# EAGLE design lichtenstein_onion (EAGLE 9.0.1)
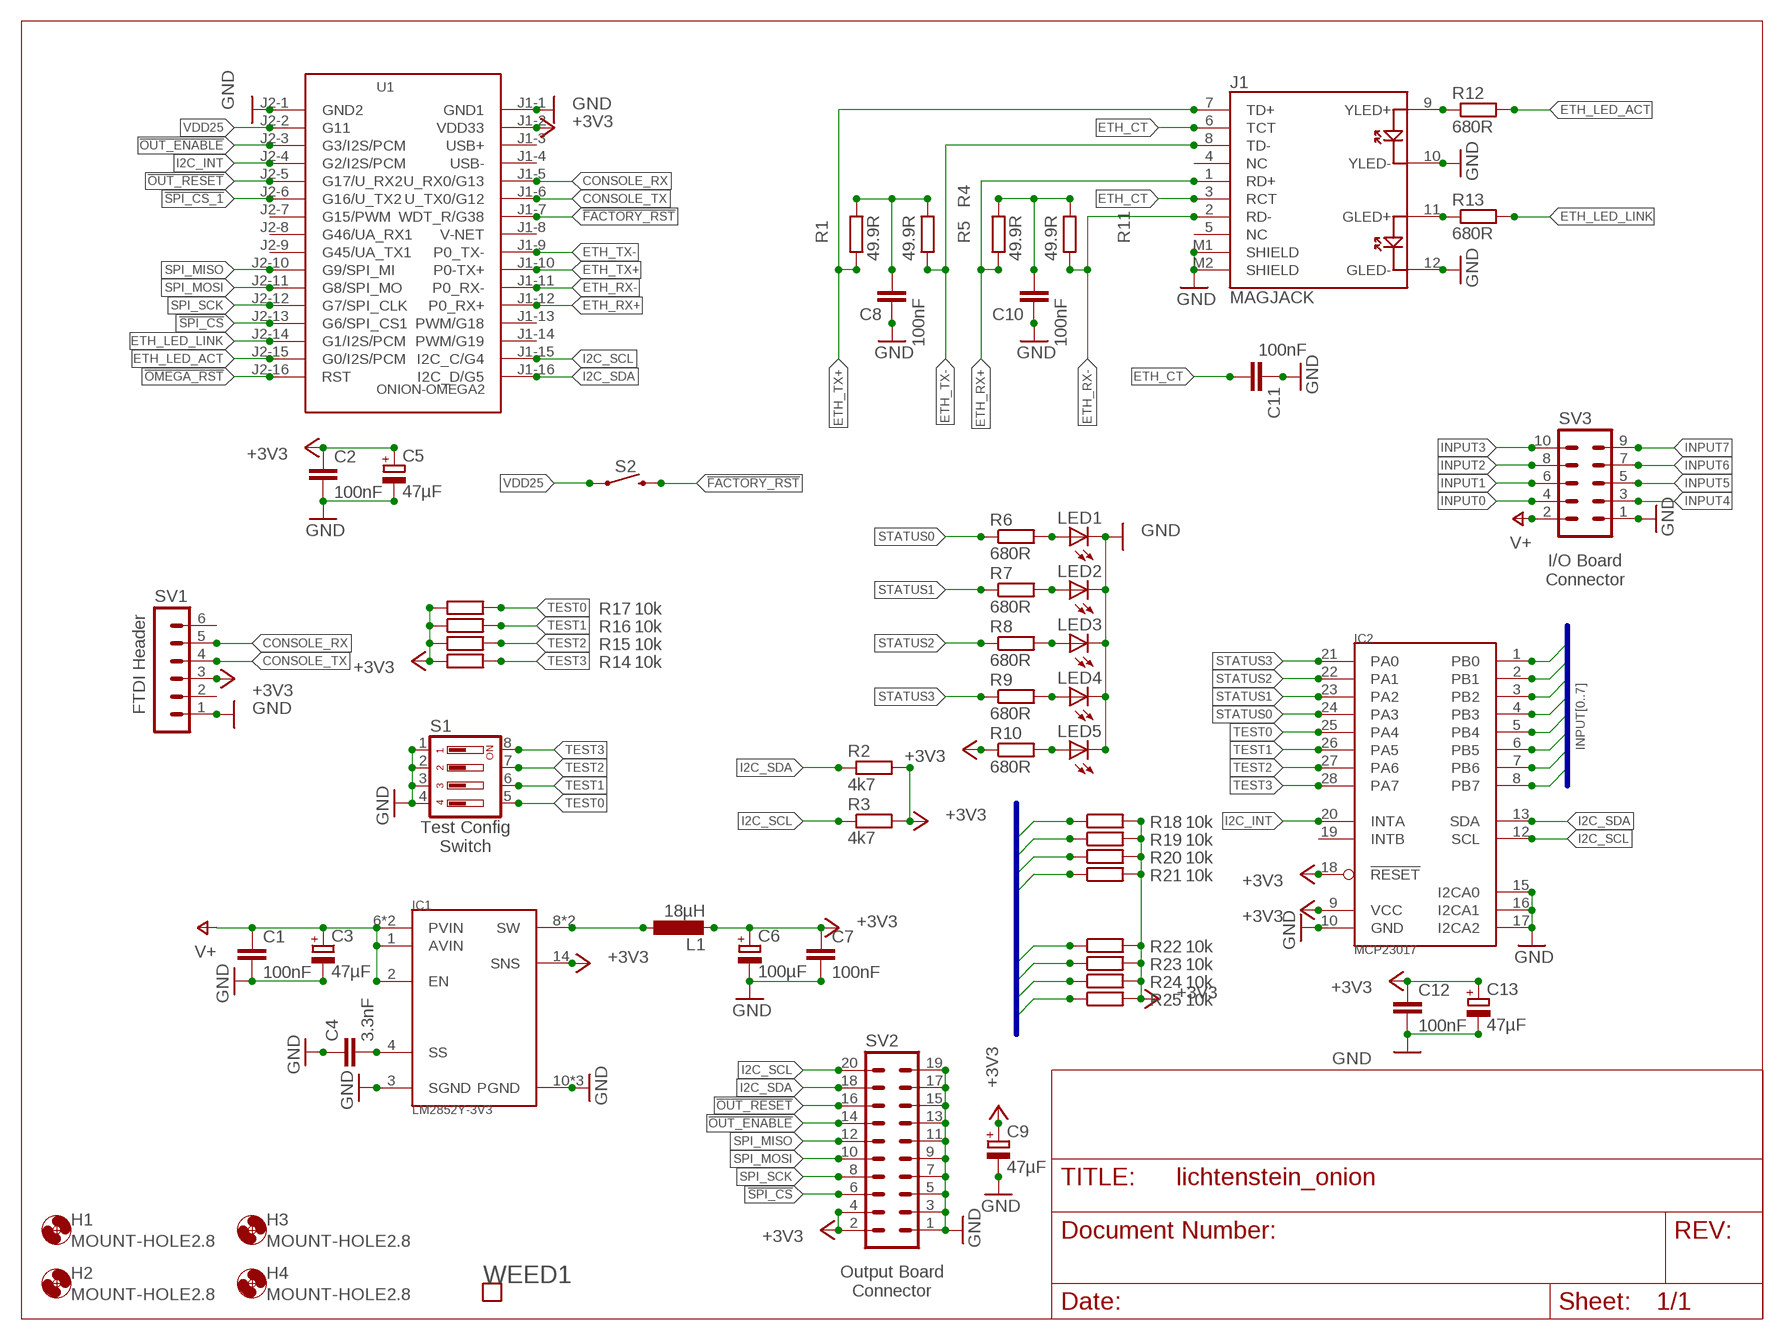
[diagram p0: schematic, sheet 1]

## Parts
C1  100nF  C-EUC0805  [C0805]
C2  100nF  C-EUC0805  [C0805]
C3  47µF  CPOL-EUCT7343  [CT7343]
C4  3.3nF  C-EUC0805  [C0805]
C5  47µF  CPOL-EUCT7343  [CT7343]
C6  100µF  CPOL-EUCT7343  [CT7343]
C7  100nF  C-EUC0805  [C0805]
C8  100nF  C-EUC0805  [C0805]
C9  47µF  CPOL-EUSMCD  [SMC_D]
C10  100nF  C-EUC0805  [C0805]
C11  100nF  C-EUC0805  [C0805]
C12  100nF  C-EUC0805  [C0805]
C13  47µF  CPOL-EUCT7343  [CT7343]
H1  MOUNT-HOLE2.8  [2,8]
H2  MOUNT-HOLE2.8  [2,8]
H3  MOUNT-HOLE2.8  [2,8]
H4  MOUNT-HOLE2.8  [2,8]
IC1  LM2852Y-3V3  LM2852HTSSOP14  [HTSSOP14]
IC2  MCP23017  MCP23017SSOP28  [SSOP28]
J1  MAGJACK  [MAGJACK]
L1  18µH  SRR1050A  [SRR1050A]
LED1  LEDCHIPLED_1206  [CHIPLED_1206]
LED2  LEDCHIPLED_1206  [CHIPLED_1206]
LED3  LEDCHIPLED_1206  [CHIPLED_1206]
LED4  LEDCHIPLED_1206  [CHIPLED_1206]
LED5  LEDCHIPLED_1206  [CHIPLED_1206]
R1  49.9R  R-EU_M0805  [M0805]
R2  4k7  R-EU_M0805  [M0805]
R3  4k7  R-EU_M0805  [M0805]
R4  49.9R  R-EU_M0805  [M0805]
R5  49.9R  R-EU_M0805  [M0805]
R6  680R  R-EU_M0805  [M0805]
R7  680R  R-EU_M0805  [M0805]
R8  680R  R-EU_M0805  [M0805]
R9  680R  R-EU_M0805  [M0805]
R10  680R  R-EU_M0805  [M0805]
R11  49.9R  R-EU_M0805  [M0805]
R12  680R  R-EU_M0805  [M0805]
R13  680R  R-EU_M0805  [M0805]
R14  10k  R-EU_M0805  [M0805]
R15  10k  R-EU_M0805  [M0805]
R16  10k  R-EU_M0805  [M0805]
R17  10k  R-EU_M0805  [M0805]
R18  10k  R-EU_M0805  [M0805]
R19  10k  R-EU_M0805  [M0805]
R20  10k  R-EU_M0805  [M0805]
R21  10k  R-EU_M0805  [M0805]
R22  10k  R-EU_M0805  [M0805]
R23  10k  R-EU_M0805  [M0805]
R24  10k  R-EU_M0805  [M0805]
R25  10k  R-EU_M0805  [M0805]
S1  219-04  [CTS-219-04]
S2  MOMENTARY-SWITCH-SPST-PTH-6.0MM  [TACTILE_SWITCH_PTH_6.0MM]
SV1  MA06-1  [MA06-1]
SV2  MA10-2  [MA10-2]
SV3  MA05-2  [MA05-2]
U1  ONION-OMEGA2  [ONION-2MM-2X16]
WEED1  WEED  [DOINK]

## Nets
!FACTORY_RST: S2.3 U1.J1-7(WDT_R/G38)
!OMEGA_RST: U1.J2-16(RST)
!OUT_ENABLE: SV2.14 U1.J2-3(G3/I2S/PCM)
!OUT_RESET: SV2.16 U1.J2-5(G17/U_RX2)
!SPI_CS: SV2.6 U1.J2-13(G6/SPI_CS1)
!SPI_CS_1: U1.J2-6(G16/U_TX2)
+3V3: C2.1 C5.+ C6.+ C7.1 C9.+ C12.1 C13.+ IC1.14(SNS) IC2.9(VCC) IC2.18(!RESET) L1.P$2 R2.2 R3.2 R10.1 R14.1 R15.1 R16.1 R17.1 R18.2 R19.2 R20.2 R21.2 R22.2 R23.2 R24.2 R25.2 SV1.3 SV2.2 SV2.4 U1.J1-2(VDD33)
CONSOLE_RX: SV1.5 U1.J1-5(U_RX0/G13)
CONSOLE_TX: SV1.4 U1.J1-6(U_TX0/G12)
ETH_CT: C11.2 J1.3(RCT) J1.6(TCT)
ETH_LED_ACT: R12.2 U1.J2-15(G0/I2S/PCM)
ETH_LED_LINK: R13.2 U1.J2-14(G1/I2S/PCM)
ETH_RX+: J1.1(RD+) R5.1 U1.J1-12(P0_RX+)
ETH_RX-: J1.2(RD-) R11.1 U1.J1-11(P0_RX-)
ETH_TX+: J1.7(TD+) R1.1 U1.J1-10(P0-TX+)
ETH_TX-: J1.8(TD-) R4.1 U1.J1-9(P0_TX-)
GND: C1.2 C2.2 C3.- C4.1 C5.- C6.- C7.2 C8.1 C9.- C10.1 C11.1 C12.2 C13.- IC1.3(SGND) IC1.10(PGND) IC1.11(PGND) IC1.PAD(PGND) IC2.10(GND) IC2.15(I2CA0) IC2.16(I2CA1) IC2.17(I2CA2) J1.10(YLED-) J1.12(GLED-) J1.M1(SHIELD) J1.M2(SHIELD) LED1.C LED2.C LED3.C LED4.C LED5.C S1.1 S1.2 S1.3 S1.4 SV1.1 SV2.1 SV2.3 SV2.5 SV2.7 SV2.9 SV2.11 SV2.13 SV2.15 SV2.17 SV2.19 SV3.1 U1.J1-1(GND1) U1.J2-1(GND2)
I2C_INT: IC2.20(INTA) U1.J2-4(G2/I2S/PCM)
I2C_SCL: IC2.12(SCL) R3.1 SV2.20 U1.J1-15(I2C_C/G4)
I2C_SDA: IC2.13(SDA) R2.1 SV2.18 U1.J1-16(I2C_D/G5)
INPUT0: IC2.2(PB1) R18.1 SV3.4
INPUT1: IC2.4(PB3) R19.1 SV3.6
INPUT2: IC2.6(PB5) R24.1 SV3.8
INPUT3: IC2.8(PB7) R25.1 SV3.10
INPUT4: IC2.1(PB0) R20.1 SV3.3
INPUT5: IC2.3(PB2) R21.1 SV3.5
INPUT6: IC2.5(PB4) R23.1 SV3.7
INPUT7: IC2.7(PB6) R22.1 SV3.9
N$1: LED5.A R10.2
N$2: LED1.A R6.2
N$3: C8.2 R1.2 R4.2
N$4: J1.9(YLED+) R12.1
N$5: J1.11(GLED+) R13.1
N$6: C10.2 R5.2 R11.2
N$7: IC1.8(SW) IC1.9(SW) L1.P$1
N$8: C4.2 IC1.4(SS)
N$9: LED2.A R7.2
N$10: LED3.A R8.2
N$11: LED4.A R9.2
SPI_MISO: SV2.12 U1.J2-10(G9/SPI_MI)
SPI_MOSI: SV2.10 U1.J2-11(G8/SPI_MO)
SPI_SCK: SV2.8 U1.J2-12(G7/SPI_CLK)
STATUS0: IC2.24(PA3) R6.1
STATUS1: IC2.23(PA2) R7.1
STATUS2: IC2.22(PA1) R8.1
STATUS3: IC2.21(PA0) R9.1
TEST0: IC2.25(PA4) R17.2 S1.5
TEST1: IC2.26(PA5) R16.2 S1.6
TEST2: IC2.27(PA6) R15.2 S1.7
TEST3: IC2.28(PA7) R14.2 S1.8
V+: C1.1 C3.+ IC1.1(AVIN) IC1.2(EN) IC1.6(PVIN) IC1.7(PVIN) SV3.2
VDD25: S2.1 U1.J2-2(G11)
Unconnected: IC2.19(INTB) J1.4(NC) J1.5(NC) SV1.2 SV1.6 U1.J1-3(USB+) U1.J1-4(USB-) U1.J1-8(V-NET) U1.J1-13(PWM/G18) U1.J1-14(PWM/G19) U1.J2-7(G15/PWM) U1.J2-8(G46/UA_RX1) U1.J2-9(G45/UA_TX1)

## Buses
INPUT[0..7]

## Notes on the sheet
- I/O Board
  Connector
- FTDI Header
- Test Config
  Switch
- Output Board
  Connector

## Library data of the parts
C1 C2 C7 C8 C10-C12 = rcl:C-EU: CAPACITOR, European symbol; MOUSER: 710-885012207072; SPICEPREFIX: C
C3 C5 C9 C13 = rcl:CPOL-EU: POLARIZED CAPACITOR, European symbol; MOUSER: 581-TAJD476M016RNJV; SPICEPREFIX: C
C4 = rcl:C-EU: CAPACITOR, European symbol; MOUSER: 710-885012207089; SPICEPREFIX: C
C6 = rcl:CPOL-EU: POLARIZED CAPACITOR, European symbol; MOUSER: 581-NOSD107M006; SPICEPREFIX: C
H1-H4 = holes:MOUNT-HOLE: MOUNTING HOLE with drill center marker
IC1 = lichtenstein_onion:LM2852: 2A 500/1500kHz Synchronous Buck Regulator Information <http://www.ti.com/product/lm2852/description>; MOUSER: 926-LM2852YMXA33NOPB
IC2 = lichtenstein_onion:MCP23017; MOUSER: 579-MCP23017T-E/SS
J1 = SparkFun-Connectors:MAGJACK: MAGJACK: RJ-45 with LEDs This is a single port, RJ45 ethernet jacks with built in transformer (magnetics), status LEDs, and shielding. Here is the connector we sell at SparkFun: RJ45 Ethernet MagJack-Compatible <https://www.sparkfun.com/products/8534> (PRT-08534) Datasheet <http://www.sparkfun.com/datasheets/Prototyping/MagJack.pdf> It is used on this SparkFun product: SparkFun RJ45 MagJack Breakout <https://www.sparkfun.com/products/13021> (BOB-13021); PROD_ID: CONN-09556; SF_ID: PRT-08534
L1 = lichtenstein_onion:SRR1050A: SRR1050A Series - Shielded Power Inductors Datasheet <https://www.mouser.com/datasheet/2/54/rr1050a-964771.pdf>; MOUSER: 652-SRR1050A-180Y
LED1 = led:LED: LED OSRAM: - CHIPLED LG R971, LG N971, LY N971, LG Q971, LY Q971, LO R971, LY R971 LH N974, LH R974 LS Q976, LO Q976, LY Q976 LO Q996 - Hyper CHIPLED LW Q18S LB Q993, LB Q99A, LB R99A - SideLED LS A670, LO A670, LY A670, LG A670, LP A670 LB A673, LV A673, LT A673, LW A673 LH A674 LY A675 LS A676, LA A676, LO A676, LY A676, LW A676 LS A679, LY A679, LG A679 - Hyper Micro SIDELED® LS Y876, LA Y876, LO Y876, LY Y876 LT Y87S - SmartLED LW L88C, LW L88S LB L89C, LB L89S, LG L890 LS L89K, LO L89K, LY L89K LS L896, LA L896, LO L896, LY L896 - TOPLED LS T670, LO T670, LY T670, LG T670, LP T670 LSG T670, LSP T670, LSY T670, LOP T670, LYG T670 LG T671, LOG T671, LSG T671 LB T673, LV T673, LT T673, LW T673 LH T674 LS T676, LA T676, LO T676, LY T676, LB T676, LH T676, LSB T676, LW T676 LB T67C, LV T67C, LT T67C, LS T67K, LO T67K, LY T67K, LW E67C LS E67B, LA E67B, LO E67B, LY E67B, LB E67C, LV E67C, LT E67C LW T67C LS T679, LY T679, LG T679 LS T770, LO T770, LY T770, LG T770, LP T770 LB T773, LV T773, LT T773, LW T773 LH T774 LS E675, LA E675, LY E675, LS T675 LS T776, LA T776, LO T776, LY T776, LB T776 LHGB T686 LT T68C, LB T68C - Hyper Mini TOPLED® LB M676 - Mini TOPLED Santana® LG M470 LS M47K, LO M47K, LY M47K Source: http://www.osram.convergy.de LUXEON: - LUMILED® LXK2-PW12-R00, LXK2-PW12-S00, LXK2-PW14-U00, LXK2-PW14-V00 LXK2-PM12-R00, LXK2-PM12-S00, LXK2-PM14-U00 LXK2-PE12-Q00, LXK2-PE12-R00, LXK2-PE12-S00, LXK2-PE14-T00, LXK2-PE14-U00 LXK2-PB12-K00, LXK2-PB12-L00, LXK2-PB12-M00, LXK2-PB14-N00, LXK2-PB14-P00, LXK2-PB14-Q00 LXK2-PR12-L00, LXK2-PR12-M00, LXK2-PR14-Q00, LXK2-PR14-R00 LXK2-PD12-Q00, LXK2-PD12-R00, LXK2-PD12-S00 LXK2-PH12-R00, LXK2-PH12-S00 LXK2-PL12-P00, LXK2-PL12-Q00, LXK2-PL12-R00 Source: www.luxeon.com KINGBRIGHT: KA-3528ASYC Source: www.kingbright.com; MOUSER: 604-APTR3216SRCPRV
LED2-LED5 = led:LED: LED OSRAM: - CHIPLED LG R971, LG N971, LY N971, LG Q971, LY Q971, LO R971, LY R971 LH N974, LH R974 LS Q976, LO Q976, LY Q976 LO Q996 - Hyper CHIPLED LW Q18S LB Q993, LB Q99A, LB R99A - SideLED LS A670, LO A670, LY A670, LG A670, LP A670 LB A673, LV A673, LT A673, LW A673 LH A674 LY A675 LS A676, LA A676, LO A676, LY A676, LW A676 LS A679, LY A679, LG A679 - Hyper Micro SIDELED® LS Y876, LA Y876, LO Y876, LY Y876 LT Y87S - SmartLED LW L88C, LW L88S LB L89C, LB L89S, LG L890 LS L89K, LO L89K, LY L89K LS L896, LA L896, LO L896, LY L896 - TOPLED LS T670, LO T670, LY T670, LG T670, LP T670 LSG T670, LSP T670, LSY T670, LOP T670, LYG T670 LG T671, LOG T671, LSG T671 LB T673, LV T673, LT T673, LW T673 LH T674 LS T676, LA T676, LO T676, LY T676, LB T676, LH T676, LSB T676, LW T676 LB T67C, LV T67C, LT T67C, LS T67K, LO T67K, LY T67K, LW E67C LS E67B, LA E67B, LO E67B, LY E67B, LB E67C, LV E67C, LT E67C LW T67C LS T679, LY T679, LG T679 LS T770, LO T770, LY T770, LG T770, LP T770 LB T773, LV T773, LT T773, LW T773 LH T774 LS E675, LA E675, LY E675, LS T675 LS T776, LA T776, LO T776, LY T776, LB T776 LHGB T686 LT T68C, LB T68C - Hyper Mini TOPLED® LB M676 - Mini TOPLED Santana® LG M470 LS M47K, LO M47K, LY M47K Source: http://www.osram.convergy.de LUXEON: - LUMILED® LXK2-PW12-R00, LXK2-PW12-S00, LXK2-PW14-U00, LXK2-PW14-V00 LXK2-PM12-R00, LXK2-PM12-S00, LXK2-PM14-U00 LXK2-PE12-Q00, LXK2-PE12-R00, LXK2-PE12-S00, LXK2-PE14-T00, LXK2-PE14-U00 LXK2-PB12-K00, LXK2-PB12-L00, LXK2-PB12-M00, LXK2-PB14-N00, LXK2-PB14-P00, LXK2-PB14-Q00 LXK2-PR12-L00, LXK2-PR12-M00, LXK2-PR14-Q00, LXK2-PR14-R00 LXK2-PD12-Q00, LXK2-PD12-R00, LXK2-PD12-S00 LXK2-PH12-R00, LXK2-PH12-S00 LXK2-PL12-P00, LXK2-PL12-Q00, LXK2-PL12-R00 Source: www.luxeon.com KINGBRIGHT: KA-3528ASYC Source: www.kingbright.com; MOUSER: 604-APTR3216SGC
R1 R5 R11 = rcl:R-EU_: RESISTOR, European symbol; MOUSER: 652-CR0805FX-49R9ELF; SPICEPREFIX: R
R2-R4 = rcl:R-EU_: RESISTOR, European symbol; MOUSER: 652-CR0805-FX4701GLF; SPICEPREFIX: R
R6-R10 R12 R13 = rcl:R-EU_: RESISTOR, European symbol; MOUSER: 652-CR0805-FX6800GLF; SPICEPREFIX: R
R14-R25 = rcl:R-EU_: RESISTOR, European symbol; MOUSER: 652-CR0805FX-1002ELF; SPICEPREFIX: R
S1 = switch-dil:219-04*: Surface Mount DIP Switch Series 219 SMT CTS Electronic Components Sourc: www.ctscorp.com; MOUSER: 774-219-4LPS; OC_FARNELL: unknown; OC_NEWARK: unknown
S2 = SparkFun-Switches:MOMENTARY-SWITCH-SPST: Momentary Switch (Pushbutton) - SPST Normally-open (NO) SPST momentary switches (buttons, pushbuttons). Variants PTH-12MM - 12mm square, through-hole Momentary Pushbutton Switch - 12mm Square <https://www.sparkfun.com/products/9190> (COM-09190) PTH-6.0MM, PTH-6.0MM-KIT - 6.0mm square, through-hole Mini Pushbutton Switch <https://www.sparkfun.com/products/97> (COM-00097) KIT package intended for soldering kit's - only one side of pads' copper is exposed. PTH-RIGHT-ANGLE-KIT - Right-angle, through-hole Right Angle Tactile Button <https://www.sparkfun.com/products/10791> - Used on SparkFun BigTime Watch Kit <https://www.sparkfun.com/products/11734> SMD-12MM - 12mm square, surface-mount Tactile Button - SMD (12mm) <https://www.sparkfun.com/products/12993> (COM-12993) Used on SparkFun PicoBoard <https://www.sparkfun.com/products/11888> SMD-4.5MM - 4.5mm Square Trackball Switch Used on SparkFun Blackberry Trackballer Breakout <https://www.sparkfun.com/products/13169> SMD-4.6MMX2.8MM - 4.60mm x 2.80mm, surface mount Used on SparkFun SAMD21 Mini Breakout <https://www.sparkfun.com/products/13664> SMD-5.2MM, SMD-5.2-REDUNDANT - 5.2mm square, surface-mount Mini Pushbutton Switch - SMD <https://www.sparkfun.com/products/8720> (COM-08720) Used on Arduino Pro Mini <https://www.sparkfun.com/products/11114> REDUNDANT package connects both switch circuits together SMD-6.0X3.5MM - 6.0 x 3.5mm, surface mount Momentary Reset Switch SMD <https://www.sparkfun.com/products/8229> (COM-08229) SMD-6.2MM-TALL - 6.2mm square, surface mount Tactile Button - SMD (6mm) <https://www.sparkfun.com/products/12992> Used on SparkFun Digital Sandbox <https://www.sparkfun.com/products/12651> SMD-RIGHT-ANGLE - Right-angle, surface mount Used on SparkFun Block for Intel® Edison - Arduino <https://www.sparkfun.com/products/13036>; MOUSER: 612-TL1105B; PROD_ID: SWCH-08441; SF_SKU: COM-00097
SV1 = con-lstb:MA06-1: PIN HEADER; OC_FARNELL: unknown; OC_NEWARK: unknown
SV2 = con-lstb:MA10-2: PIN HEADER; MOUSER: 517-30320-6002; OC_FARNELL: unknown; OC_NEWARK: unknown
SV3 = con-lstb:MA05-2: PIN HEADER; MOUSER: 517-30310-6002; OC_FARNELL: unknown; OC_NEWARK: unknown
U1 = lichtenstein_onion:ONION-OMEGA2: Onion Omega; MOUSER: 353-OM-O2P
WEED1 = lichtenstein_onion:WEED

## Board
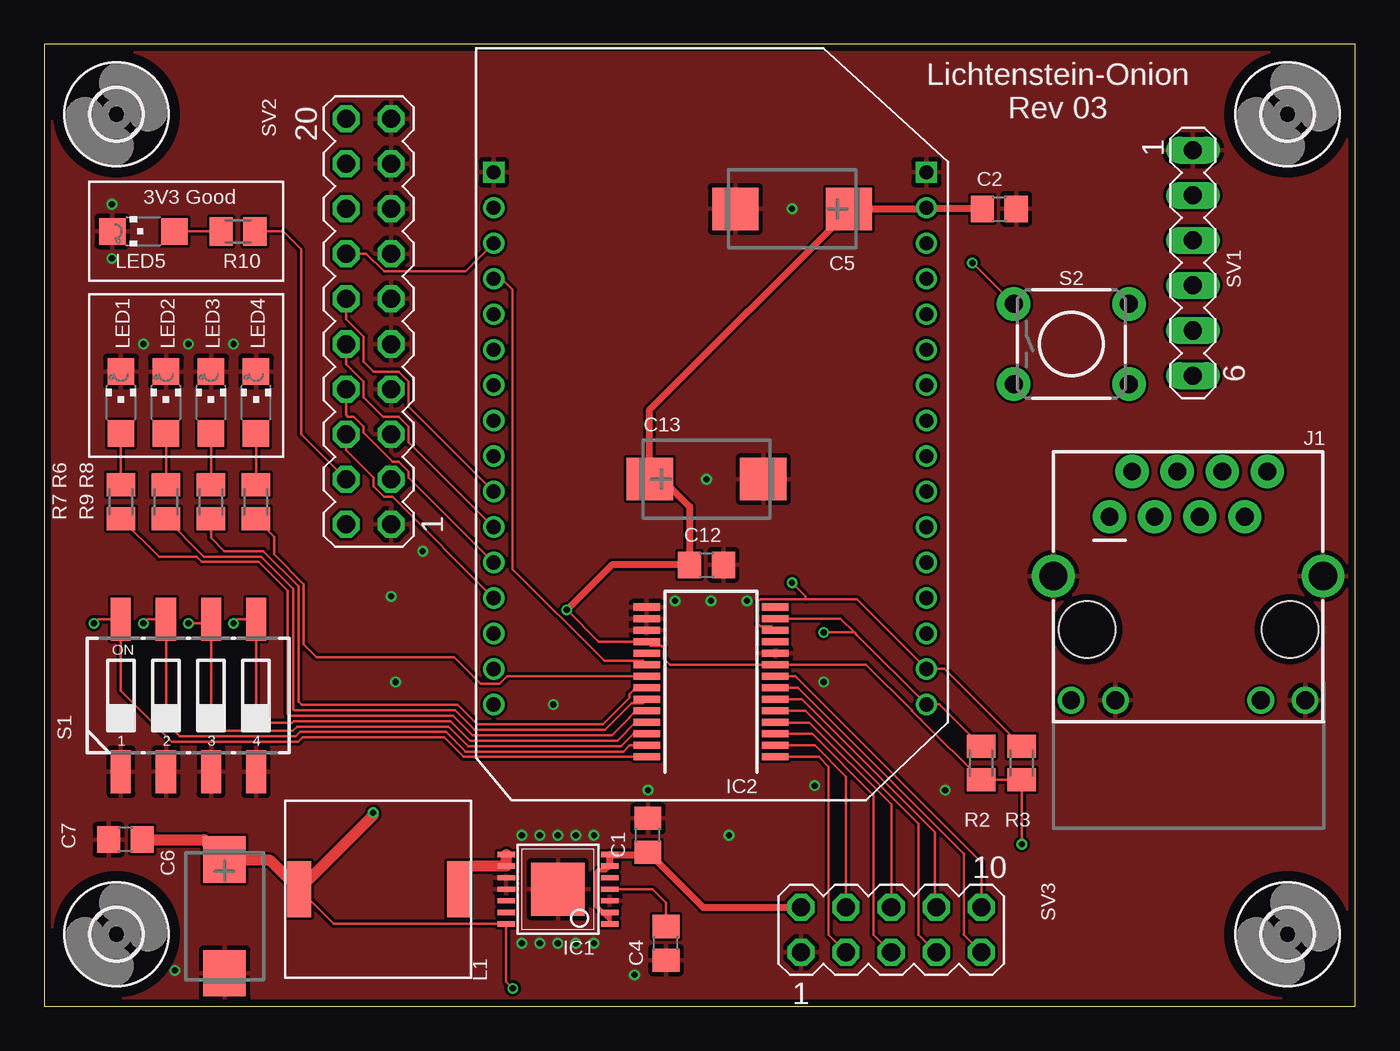
[diagram p1: board, top side]
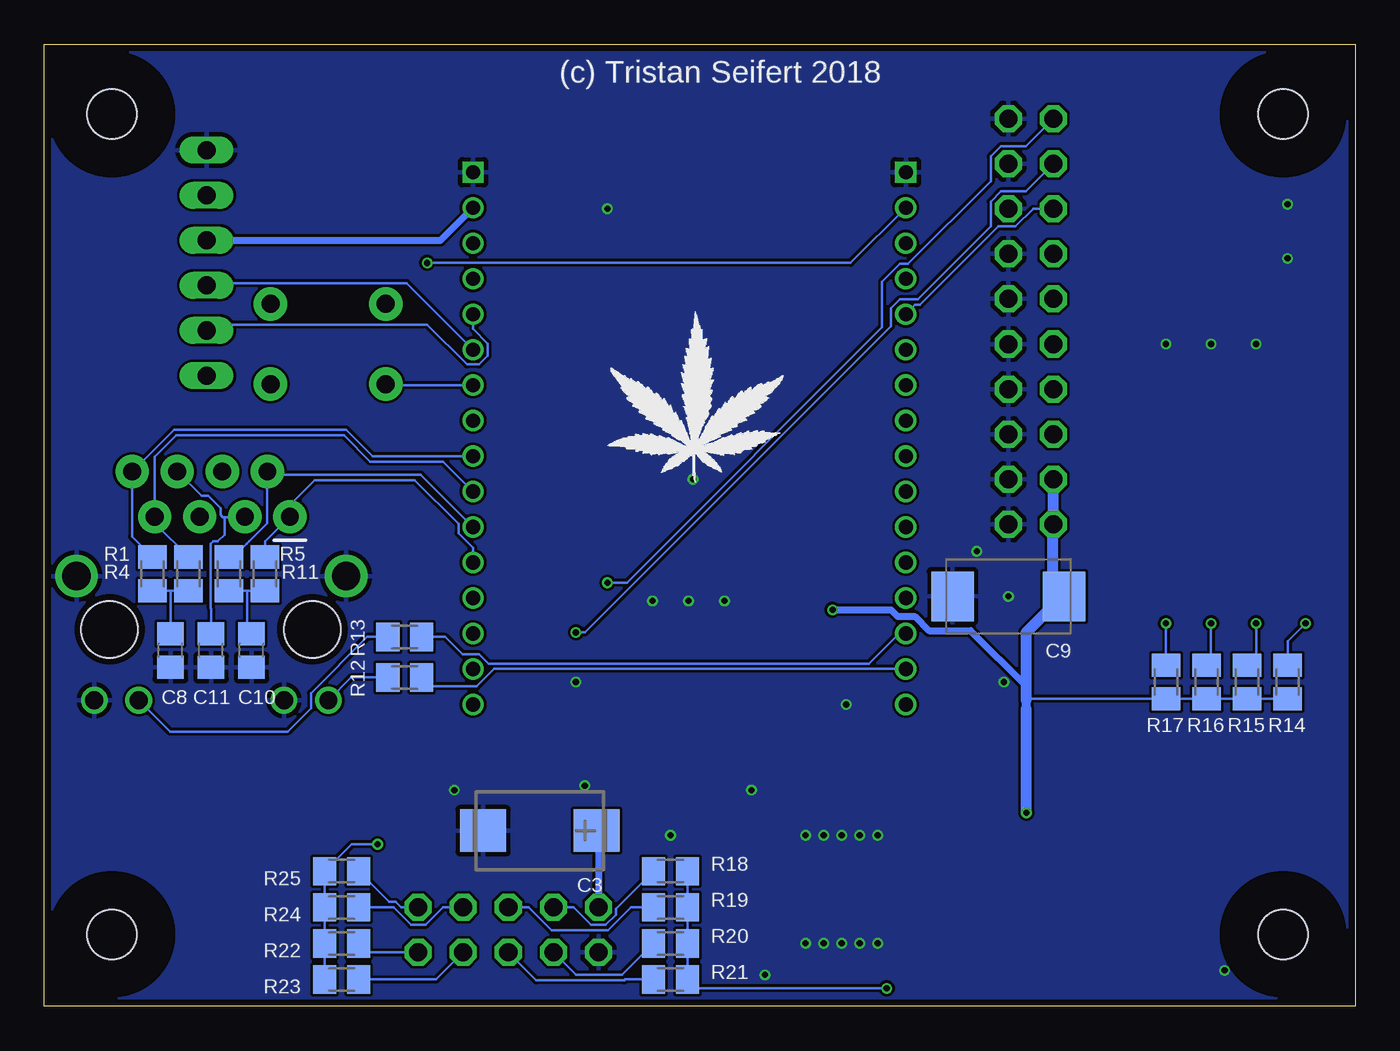
[diagram p2: board, bottom side, seen from below]

Size 73.91 x 54.23 mm. Coordinates in mm from the lower left corner, seen from the top.
Outline: 0,0 73.91,0 73.91,54.23 0,54.23 0,0
Copper layers (1*16): Top 0.035559375mm / dielectric 1.6mm / Bottom 0.035559375mm
Design rules "oshpark-2layer": minimum track width 6mil, minimum drill 10mil, track to track 6mil, track to pad 6mil, pad to pad 6mil, via to via 6mil, smd to smd 6mil, copper to edge 15mil, drill to drill 6mil, minimum pad ring 5mil, minimum via ring 5mil, stop-mask expansion 2.5mil, vias tented up to drill 0mil, thermal gap 10mil

### Footprints (pad centres in the part's own frame; a part is rotated, then mirrored left to right if it is on the bottom)
C0805 = smd 1.3 x 1.5: 1 -0.95,0; 2 0.95,0
CT7343 = smd 2.6 x 2.4: + -3.2,0; - 3.2,0
SMC_D = smd 2.4 x 2.8: + -3.15,0; - 3.15,0
2,8 = hole 2.8: 0,0
HTSSOP14 = smd 0.305 x 0.991: 1 -1.95,-2.918; 2 -1.3,-2.918; 3 -0.65,-2.918; 4 0,-2.918; 5 0.65,-2.918; 6 1.3,-2.918; 7 1.95,-2.918; 8 1.95,2.918; 9 1.3,2.918; 10 0.65,2.918; 11 0,2.918; 12 -0.65,2.918; 13 -1.3,2.918; 14 -1.95,2.918 | smd 3 x 3: PAD 0,0
SSOP28 = smd 0.4 x 1.5: 1 -4.225,-3.625; 2 -3.575,-3.625; 3 -2.925,-3.625; 4 -2.275,-3.625; 5 -1.625,-3.625; 6 -0.975,-3.625; 7 -0.325,-3.625; 8 0.325,-3.625; 9 0.975,-3.625; 10 1.625,-3.625; 11 2.275,-3.625; 12 2.925,-3.625; 13 3.575,-3.625; 14 4.225,-3.625; 15 4.225,3.625; 16 3.575,3.625; 17 2.925,3.625; 18 2.275,3.625; 19 1.625,3.625; 20 0.975,3.625; 21 0.325,3.625; 22 -0.325,3.625; 23 -0.975,3.625; 24 -1.625,3.625; 25 -2.275,3.625; 26 -2.925,3.625; 27 -3.575,3.625; 28 -4.225,3.625
MAGJACK = drill 1 pad 1.88: 1 3.175,17.445; 2 4.445,19.985; 3 5.715,17.445; 4 6.985,19.985; 5 8.255,17.445; 6 9.525,19.985; 7 10.795,17.445; 8 12.065,19.985 | drill 1 pad 1.27: 9 1,7.1; 10 3.5,7.1; 11 11.7,7.1; 12 14.2,7.1 | drill 1.6 pad 2.184: M1 0,14.1; M2 15.2,14.1 | hole 3.2: 1.905,11.095; 13.335,11.095
SRR1050A = smd 3.15 x 1.325: P$1 0,0; P$2 0,-9
CHIPLED_1206 = smd 1.5 x 1.5: A 0,-1.75; C 0,1.75
M0805 = smd 1.3 x 1.6: 1 -0.95,0; 2 0.95,0
CTS-219-04 = smd 1.13 x 2.44: 1 -3.81,-4.3; 2 -1.27,-4.3; 3 1.27,-4.3; 4 3.81,-4.3; 5 3.81,4.3; 6 1.27,4.3; 7 -1.27,4.3; 8 -3.81,4.3
TACTILE_SWITCH_PTH_6.0MM = drill 1.016 pad 1.88: 1 -3.251,2.261; 2 3.251,2.261; 3 -3.251,-2.261; 4 3.251,-2.261
MA06-1 = drill 1.016 long: 1 -6.35,0; 2 -3.81,0; 3 -1.27,0; 4 1.27,0; 5 3.81,0; 6 6.35,0
MA10-2 = drill 1.016 octagon: 1 -11.43,-1.27; 2 -11.43,1.27; 3 -8.89,-1.27; 4 -8.89,1.27; 5 -6.35,-1.27; 6 -6.35,1.27; 7 -3.81,-1.27; 8 -3.81,1.27; 9 -1.27,-1.27; 10 -1.27,1.27; 11 1.27,-1.27; 12 1.27,1.27; 13 3.81,-1.27; 14 3.81,1.27; 15 6.35,-1.27; 16 6.35,1.27; 17 8.89,-1.27; 18 8.89,1.27; 19 11.43,-1.27; 20 11.43,1.27
MA05-2 = drill 1.016 octagon: 1 -5.08,-1.27; 2 -5.08,1.27; 3 -2.54,-1.27; 4 -2.54,1.27; 5 0,-1.27; 6 0,1.27; 7 2.54,-1.27; 8 2.54,1.27; 9 5.08,-1.27; 10 5.08,1.27
ONION-2MM-2X16 = drill 0.8 square: J1-1 12.4,14; J2-1 -12,14 | drill 0.8: J1-2 12.4,12; J1-3 12.4,10; J1-4 12.4,8; J1-5 12.4,6; J1-6 12.4,4; J1-7 12.4,2; J1-8 12.4,0; J1-9 12.4,-2; J1-10 12.4,-4; J1-11 12.4,-6; J1-12 12.4,-8; J1-13 12.4,-10; J1-14 12.4,-12; J1-15 12.4,-14; J1-16 12.4,-16; J2-2 -12,12; J2-3 -12,10; J2-4 -12,8; J2-5 -12,6; J2-6 -12,4; J2-7 -12,2; J2-8 -12,0; J2-9 -12,-2; J2-10 -12,-4; J2-11 -12,-6; J2-12 -12,-8; J2-13 -12,-10; J2-14 -12,-12; J2-15 -12,-14; J2-16 -12,-16

### Placement (x,y rotation side)
C1  34.04,9.65 90 top
C2  53.85,44.96 0 top
C3  45.97,9.91 180 bottom
C4  35.05,3.56 90 top
C5  42.16,44.96 180 top
C6  10.16,5.08 270 top
C7  4.57,9.4 180 top
C8  66.8,20.07 90 bottom
C9  19.56,23.11 180 bottom
C10  62.23,20.07 90 bottom
C11  64.52,20.07 90 bottom
C12  37.34,24.89 0 top
C13  37.34,29.72 0 top
H1  4.06,4.06 0 top
H2  70.1,4.06 0 top
H3  4.06,50.29 0 top
H4  70.1,50.29 0 top
IC1  28.96,6.6 90 top
IC2  37.59,18.29 90 top
J1  56.9,10.16 0 top
L1  23.37,6.6 270 top
LED1  4.32,34.04 0 top
LED2  6.86,34.04 0 top
LED3  9.4,34.04 0 top
LED4  11.94,34.04 0 top
LED5  5.59,43.69 90 top
R1  65.79,24.38 270 bottom
R2  52.83,13.72 270 top
R3  55.12,13.72 270 top
R4  67.82,24.38 270 bottom
R5  61.47,24.38 270 bottom
R6  4.32,28.45 90 top
R7  6.86,28.45 90 top
R8  9.4,28.45 90 top
R9  11.94,28.45 90 top
R10  10.92,43.69 180 top
R11  63.5,24.38 270 bottom
R12  53.59,18.54 0 bottom
R13  53.59,20.83 0 bottom
R14  3.81,18.29 90 bottom
R15  6.1,18.29 90 bottom
R16  8.38,18.29 90 bottom
R17  10.67,18.29 90 bottom
R18  38.61,7.62 0 bottom
R19  38.61,5.59 0 bottom
R20  38.61,3.56 0 bottom
R21  38.61,1.52 0 bottom
R22  57.15,3.56 180 bottom
R23  57.15,1.52 180 bottom
R24  57.15,5.59 180 bottom
R25  57.15,7.62 180 bottom
S1  8.13,17.53 0 top
S2  57.91,37.34 0 top
SV1  64.77,41.91 270 top
SV2  18.29,38.61 90 top
SV3  47.75,4.32 0 top
U1  37.34,33.02 0 top
WEED1  42.16,29.46 0 bottom

### Tracks (layer width: path | path; a pad name or v marks a point on that pad's centre or on a via)
!FACTORY_RST
  Bottom 0.152: U1.J1-7 54.6,35.02 S2.3
!OUT_ENABLE
  Top 0.152: SV2.14 18.16,42.42 19.15,41.43 23.75,41.43 U1.J2-3
!OUT_RESET
  Bottom 0.152: U1.J2-5 24.81,39.54 24.54,39.54 20.12,43.97 19.15,43.97 18.16,44.96 SV2.16
!SPI_CS
  Top 0.152: SV2.6 17.02,31.34 18.57,29.79 18.57,29.31 19.15,28.73 19.63,28.73 U1.J2-13
+3V3  (via drill 0.35)
  Top 0.152: 49.68,44.96 U1.J1-2 | U1.J1-2 | 49.78,44.96 U1.J1-2 | SV2.4 14.48,32.26 14.48,42.67 13.46,43.69 R10.1 | v29.46,22.35 31.25,20.56 IC2.18 34.19,20.34 34.81,20.34 34.95,20.21 34.95,19.58 35.27,19.26 IC2.9 46.34,19.26 48.91,16.69 48.91,16.68 49.4,16.19 49.41,16.19 R2.2 R3.2 v55.12,9.14 | v26.42,1.02 26.04,1.39 IC1.14 16.32,4.65 L1.P$2 | 10.21,8.23 C6.+
  Top 0.254: 18.54,10.78 v18.54,10.92
  Top 0.406: 49.68,44.96 C5.+ 45.36,44.86 34.14,33.63 C13.+ 34.84,29.72 36.39,28.17 C12.1 32,24.89 v29.46,22.35 | C2.1 49.78,44.96
  Top 0.61: 18.54,10.78 L1.P$2 12.74,8.23 10.21,8.23 | C7.1 8.99,9.4 C6.+
  Bottom 0.152: 18.5,16.73 18.54,16.76 | R14.1 R15.1 R16.1 R17.1 18.48,17.34 18.54,17.27 | R23.2 R22.2 R24.2 R25.2 56.58,9.14 v55.12,9.14 | R18.2 R19.2 R20.2 R21.2 37.15,1.02 v26.42,1.02
  Bottom 0.254: 17.06,27.14 SV2.2
  Bottom 0.406: SV1.3 51.58,43.18 U1.J1-2 | v29.46,22.35 26.17,22.35 25.8,21.99 24.83,21.99 24.02,21.18 21.69,21.18 18.54,18.03 | C9.+ 16.46,23.16 17.06,23.76
  Bottom 0.508: 18.54,16.76 18.54,17.27
  Bottom 0.61: SV2.2 SV2.4 | 17.06,23.76 17.06,27.14 | v18.54,10.92 18.54,16.76 | 18.54,17.27 18.54,18.03 18.54,21.08 16.46,23.16
CONSOLE_RX
  Bottom 0.152: U1.J1-5 49.74,38.19 48.91,37.36 48.91,36.68 49.4,36.19 50.08,36.19 52.32,38.43 64.44,38.43 SV1.5
CONSOLE_TX
  Bottom 0.152: U1.J1-6 53.48,40.77 64.64,40.77 SV1.4
ETH_CT
  Bottom 0.152: J1.3 62.63,27.58 63.75,27.58 | C11.2 64.52,22.42 64.53,22.43 64.53,26.08 64.39,26.21 64.14,26.21 63.75,26.6 63.75,27.58 | 63.75,27.58 63.86,27.58 63.98,27.71 63.98,28.09 64.67,28.77 65.05,28.77 J1.6
ETH_LED_ACT
  Bottom 0.152: U1.J2-15 48.54,19.02 49.53,18.03 52.14,18.03 R12.2
ETH_LED_LINK
  Bottom 0.152: U1.J2-14 25.72,21.02 27.41,19.32 48.87,19.32 49.4,19.85 50.33,19.85 51.31,20.83 R13.2
ETH_RX+
  Bottom 0.152: J1.1 60.22,27.45 | 60.22,27.45 61.47,26.21 R5.1 | 60.22,27.45 60.22,28.12 58.67,29.67 53.03,29.67 50.57,27.2 50.57,26.68 49.74,25.85 U1.J1-12
ETH_RX-
  Bottom 0.152: 61.34,29.97 61.34,27.22 62.35,26.21 62.36,26.21 62.5,26.08 62.5,26.07 63.23,25.33 R11.1 | 61.34,29.97 J1.2 | U1.J1-11 52.69,29.97 61.34,29.97
ETH_TX+
  Bottom 0.152: R1.1 67.69,27.24 J1.7 67.69,30.98 66.47,32.21 57.02,32.21 55.53,30.71 51.43,30.71 U1.J1-10
ETH_TX-
  Bottom 0.152: R4.1 68.96,26.48 J1.8 66.59,32.51 56.9,32.51 55.4,31.02 U1.J1-9
GND  (via drill 0.35)
  other vias: 33.27,1.78 34.04,12.19 7.37,2.03 8.13,37.34 5.59,37.34 10.67,37.34 3.81,45.21 3.81,42.16 42.16,44.96 37.34,29.72 37.59,22.86 35.56,22.86 39.62,22.86 28.7,17.02 19.81,18.29 43.43,12.45 43.94,18.29 26.92,9.65 30.99,9.65 28.96,9.65 27.94,9.65 29.97,9.65 28.96,3.56 26.92,3.56 30.99,3.56 29.97,3.56 27.94,3.56 21.34,25.65 19.56,23.11 50.8,12.19 38.61,9.65
  pour Top: 0,54.23 0,0 73.91,0 73.91,54.23
  pour Bottom: 0,54.23 0,0 73.91,0 73.91,54.23
I2C_INT
  Top 0.152: IC2.20 33.75,19.48 31.58,19.48 26.42,24.65 26.42,40.39 25.78,41.02 U1.J2-4
I2C_SCL  (via drill 0.35)
  Top 0.152: R3.1 50.76,19.02 U1.J1-15 45.82,22.94 42.93,22.94 | IC2.12 41,21.43 40.37,21.43 40.24,21.57 40.24,22.81 40.37,22.94 42.93,22.94 | v42.16,23.88 42.93,23.11 42.93,22.94
  Bottom 0.152: SV2.20 18.57,48.49 19.97,48.49 20.55,47.91 20.55,46.51 25.21,41.85 25.68,41.85 26.67,40.86 26.67,38.28 41.07,23.88 v42.16,23.88
I2C_SDA  (via drill 0.35)
  Top 0.152: R2.1 50.48,17.02 U1.J1-16 45.83,20.93 45.68,21.08 | 45.68,21.08 44.9,21.86 IC2.13 | v43.94,21.08 45.68,21.08
  Bottom 0.152: v43.94,21.08 43.43,21.08 26.17,38.35 26.17,39.36 25.68,39.85 24.67,39.85 20.55,43.97 20.55,45.37 19.97,45.95 18.57,45.95 SV2.18
INPUT0
  Top 0.152: IC2.2 43.45,14.71 45.21,12.95 SV3.4
  Bottom 0.152: SV3.4 44.07,5.59 43.08,4.6 42.26,4.6 41.68,5.18 41.68,5.5 R18.1
INPUT1
  Top 0.152: IC2.4 43.16,16 47.75,11.41 SV3.6
  Bottom 0.152: SV3.6 46.61,5.59 45.32,4.29 42.13,4.29 40.84,5.59 R19.1
INPUT2
  Top 0.152: IC2.6 42.71,17.31 50.2,9.82 50.2,5.68 SV3.8
  Bottom 0.152: R24.1 54.23,5.59 53.24,4.6 52.42,4.6 51.43,5.59 SV3.8
INPUT3
  Top 0.152: IC2.8 42.35,18.61 52.83,8.13 SV3.10
  Bottom 0.152: R25.1 54.47,5.89 54.11,5.89 53.8,5.59 SV3.10
INPUT4
  Top 0.152: IC2.1 43.67,14.06 44.22,13.51 44.22,4.04 SV3.3
  Bottom 0.152: R20.1 41.34,1.78 43.94,1.78 SV3.3
INPUT5
  Top 0.152: IC2.3 43.31,15.36 46.76,11.91 46.76,4.04 SV3.5
  Bottom 0.152: R21.1 41.16,1.52 41.21,1.47 46.18,1.47 SV3.5
INPUT6
  Top 0.152: IC2.5 42.93,16.66 49.3,10.29 49.3,4.04 SV3.7
  Bottom 0.152: R23.1 51.82,1.52 SV3.7
INPUT7
  Top 0.152: IC2.7 42.49,17.96 51.84,8.61 51.84,4.04 SV3.9
  Bottom 0.152: R22.1 55.69,3.05 SV3.9
N$1
  Top 0.152: LED5.A R10.2
N$2
  Top 0.152: LED1.A R6.2
N$3
  Bottom 0.152: R1.2 66.8,23.43 | 66.8,23.43 R4.2 | C8.2 66.8,23.43
N$4
  Bottom 0.152: R12.1 56.61,18.54 J1.9
N$5
  Bottom 0.152: R13.1 55.71,20.83 58.88,17.66 58.88,16.82 60.2,15.49 66.83,15.49 J1.11
N$6
  Bottom 0.152: 62.48,21.52 C10.2 62.48,21.27 62.48,23.43 | R5.2 62.48,23.43 | 62.48,23.43 R11.2
N$7
  Top 0.254: 23.72,7.62 23.71,7.55 23.62,7.11 23.37,6.86 L1.P$1
  Top 0.508: 24.06,7.9 23.71,7.55
  Top 0.61: IC1.8 IC1.9 24.06,7.9
N$8
  Top 0.152: C4.2 35.05,5.84 34.29,6.6 IC1.4
N$9
  Top 0.152: LED2.A R7.2
N$10
  Top 0.152: LED3.A R8.2
N$11
  Top 0.152: LED4.A R9.2
SPI_MISO
  Top 0.152: U1.J2-10 20.55,33.81 20.55,35.21 19.97,35.79 18.57,35.79 18.01,36.35 18.01,37.75 17.02,38.74 SV2.12
SPI_MOSI
  Top 0.152: U1.J2-11 20.55,31.81 20.55,32.67 19.97,33.25 19.11,33.25 18.01,34.35 18.01,35.21 17.02,36.2 SV2.10
SPI_SCK
  Top 0.152: SV2.8 17.02,33.34 17.11,33.25 17.43,33.25 18.01,32.67 18.01,32.35 19.65,30.71 19.97,30.71 20.55,30.13 20.55,29.81 U1.J2-12
STATUS0
  Top 0.152: IC2.24 33.34,16.66 32.99,16.31 32.99,16.27 32,15.28 24.14,15.28 23.04,16.38 13.84,16.38 13.72,16.51 13.72,23.43 12.09,25.05 8.87,25.05 8.58,25.34 6.47,25.34 R6.1
STATUS1
  Top 0.152: R7.1 9,25.36 12.19,25.36 12.22,25.36 14.02,23.55 14.02,16.76 14.1,16.69 23.16,16.69 24.26,15.59 31.62,15.59 33.12,17.09 33.75,17.09 IC2.23
STATUS2
  Top 0.152: IC2.22 33.34,17.96 32.99,17.61 32.99,17.39 31.49,15.89 24.39,15.89 23.29,16.99 14.5,16.99 14.33,17.17 14.33,23.68 12.34,25.66 10.15,25.66 9.4,26.42 R8.1
STATUS3
  Top 0.152: IC2.21 26.1,18.61 25.68,18.19 24.6,18.19 23.1,19.68 15.37,19.68 14.63,20.42 14.63,23.8 12.95,25.48 12.95,26.48 R9.1
TEST0  (via drill 0.35)
  Top 0.152: IC2.25 33.34,16.01 32.31,14.98 24.01,14.98 22.91,16.08 14.05,16.08 13.97,16 12.45,16 11.94,16.51 S1.5 10.9,21.83 v10.67,21.59
  Bottom 0.152: v10.67,21.59 R17.2
TEST1  (via drill 0.35)
  Top 0.152: 9.4,21.59 9.4,16 9.87,15.53 14,15.53 14.25,15.77 22.78,15.77 23.88,14.67 32.53,14.67 33.22,15.36 IC2.26 | 9.4,21.59 S1.6 | v8.13,21.59 9.4,21.59
  Bottom 0.152: v8.13,21.59 8.13,19.49 R16.2
TEST2  (via drill 0.35)
  Top 0.152: IC2.27 33,14.71 32.66,14.37 23.76,14.37 22.66,15.47 14.43,15.47 14.18,15.22 7.64,15.22 6.86,16 S1.7 5.82,21.83 v5.59,21.59
  Bottom 0.152: R15.2 5.59,19.75 v5.59,21.59
TEST3  (via drill 0.35)
  Top 0.152: IC2.28 23.63,14.06 22.53,15.16 14.55,15.16 14.3,14.92 7.18,14.92 4.32,17.78 S1.8 3.03,21.83 v2.79,21.59
  Bottom 0.152: v2.79,21.59 3.81,20.57 R14.2
V+
  Top 0.254: 31.89,8.57 IC1.7 | IC1.2 IC1.1 31.87,4.91 31.1,5.69 31.1,7.52 31.26,7.69 31.66,7.69 IC1.6 | 34.14,8.6 C1.1 33.89,8.55
  Top 0.406: IC1.6 IC1.7 33.89,8.55 | C1.1 37.15,5.59 SV3.2
  Bottom 0.406: C3.+ 42.67,9.8 SV3.2
VDD25  (via drill 0.35)
  Top 0.152: v52.32,41.91 54.63,39.6 S2.1
  Bottom 0.152: U1.J2-2 28.45,41.91 v52.32,41.91

### Text on the board
tNames: Lichtenstein-Onion / Rev 03 | 3V3 Good
bNames: (c) Tristan Seifert 2018